# EAGLE design Youssef DHRIF (EAGLE 7.2.0)
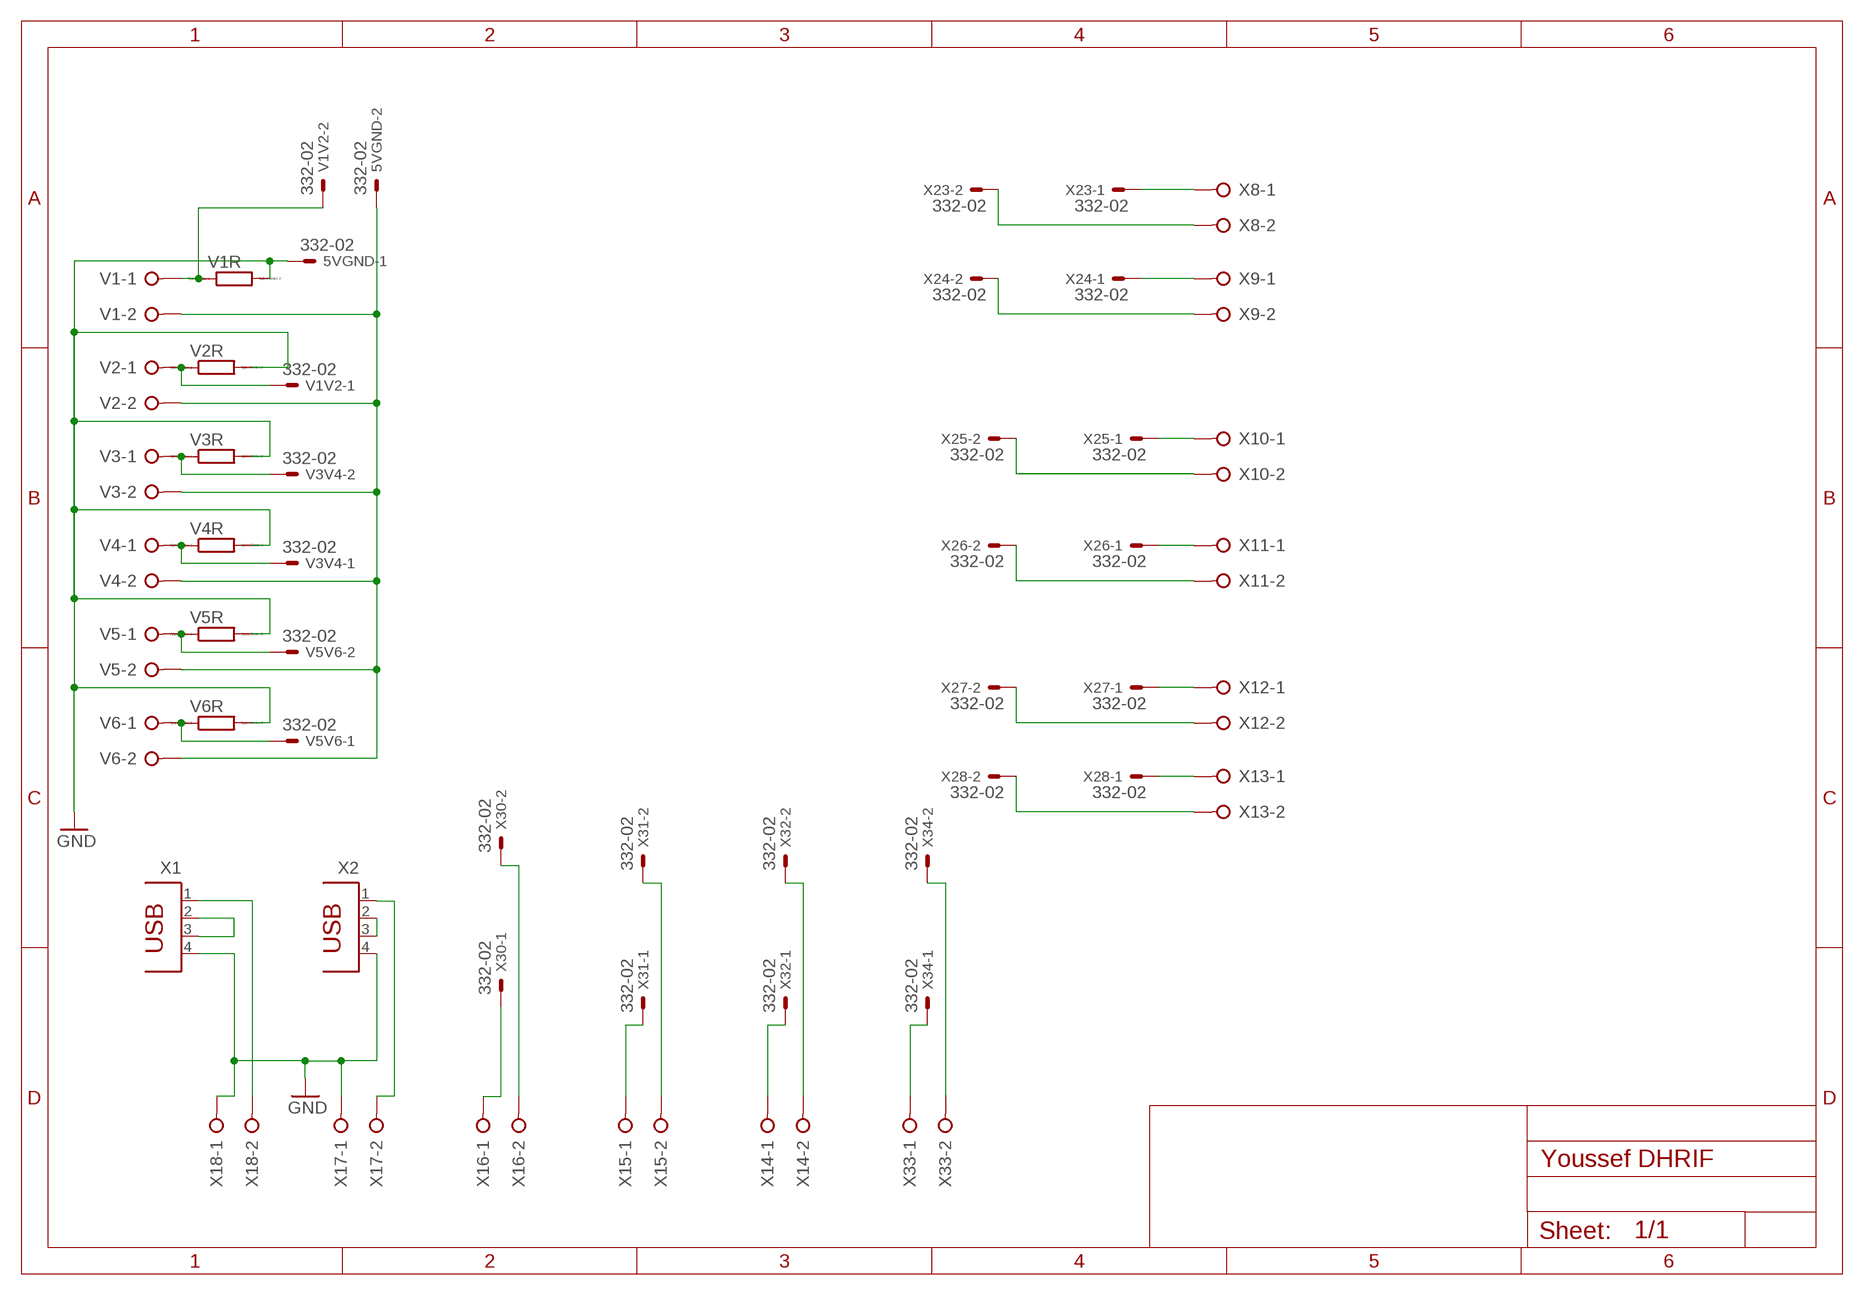
[diagram p0: schematic, sheet 1]

## Parts
5VGND  332-02  [332-02]
V1  W237-02P  [W237-132]
V1R  R0207/10  [0207/10]
V1V2  332-02  [332-02]
V2  W237-02P  [W237-132]
V2R  R0207/10  [0207/10]
V3  W237-02P  [W237-132]
V3R  R0207/10  [0207/10]
V3V4  332-02  [332-02]
V4  W237-02P  [W237-132]
V4R  R0207/10  [0207/10]
V5  W237-02P  [W237-132]
V5R  R0207/10  [0207/10]
V5V6  332-02  [332-02]
V6  W237-02P  [W237-132]
V6R  R0207/10  [0207/10]
X1  PN87520  [PN87520]
X2  PN87520  [PN87520]
X8  W237-02P  [W237-132]
X9  W237-02P  [W237-132]
X10  W237-02P  [W237-132]
X11  W237-02P  [W237-132]
X12  W237-02P  [W237-132]
X13  W237-02P  [W237-132]
X14  W237-02P  [W237-132]
X15  W237-02P  [W237-132]
X16  W237-02P  [W237-132]
X17  W237-02P  [W237-132]
X18  W237-02P  [W237-132]
X23  332-02  [332-02]
X24  332-02  [332-02]
X25  332-02  [332-02]
X26  332-02  [332-02]
X27  332-02  [332-02]
X28  332-02  [332-02]
X30  332-02  [332-02]
X31  332-02  [332-02]
X32  332-02  [332-02]
X33  W237-02P  [W237-132]
X34  332-02  [332-02]

## Nets
GND: 5VGND.1 V1R.2 V2R.2 V3R.2 V4R.2 V5R.2 V6R.2 X1.4 X2.4 X17.1 X18.1
N$2: 5VGND.2 V1.2 V2.2 V3.2 V4.2 V5.2 V6.2
N$3: V5V6.1 V6.1 V6R.1
N$4: V5.1 V5R.1 V5V6.2
N$5: V3V4.1 V4.1 V4R.1
N$6: V3.1 V3R.1 V3V4.2
N$7: V1V2.1 V2.1 V2R.1
N$8: V1.1 V1R.1 V1V2.2
N$9: X8.1 X23.1
N$10: X8.2 X23.2
N$11: X9.1 X24.1
N$12: X9.2 X24.2
N$13: X10.1 X25.1
N$14: X10.2 X25.2
N$15: X11.1 X26.1
N$16: X11.2 X26.2
N$17: X12.1 X27.1
N$18: X12.2 X27.2
N$19: X13.1 X28.1
N$20: X13.2 X28.2
N$21: X1.1 X18.2
N$23: X1.2 X1.3
N$25: X2.1 X17.2
N$26: X2.2 X2.3
N$27: X16.1 X30.1
N$28: X16.2 X30.2
N$29: X15.1 X31.1
N$30: X15.2 X31.2
N$31: X14.1 X32.1
N$32: X14.2 X32.2
N$33: X33.1 X34.1
N$34: X33.2 X34.2

## Library data of the parts
5VGND V1V2 V3V4 V5V6 X23-X28 X30-X32 X34 = con-garry:332-02: 2 Pin - 2mm Dual Row Source: www.mpe-connector.de / garry_shortform_2012.pdf
V1-V6 X8-X18 X33 = con-wago-508:W237-02P: WAGO SREW CLAMP; OC_FARNELL: unknown; OC_NEWARK: unknown
V1R V2R V3R V4R V5R V6R = eagle-ltspice:R: RESISTOR, European symbol; SPICEMODEL: NONE; SPICEPREFIX: R
X1 X2 = con-berg:PN87520: BERG USB connector; OC_FARNELL: unknown; OC_NEWARK: unknown

## Board
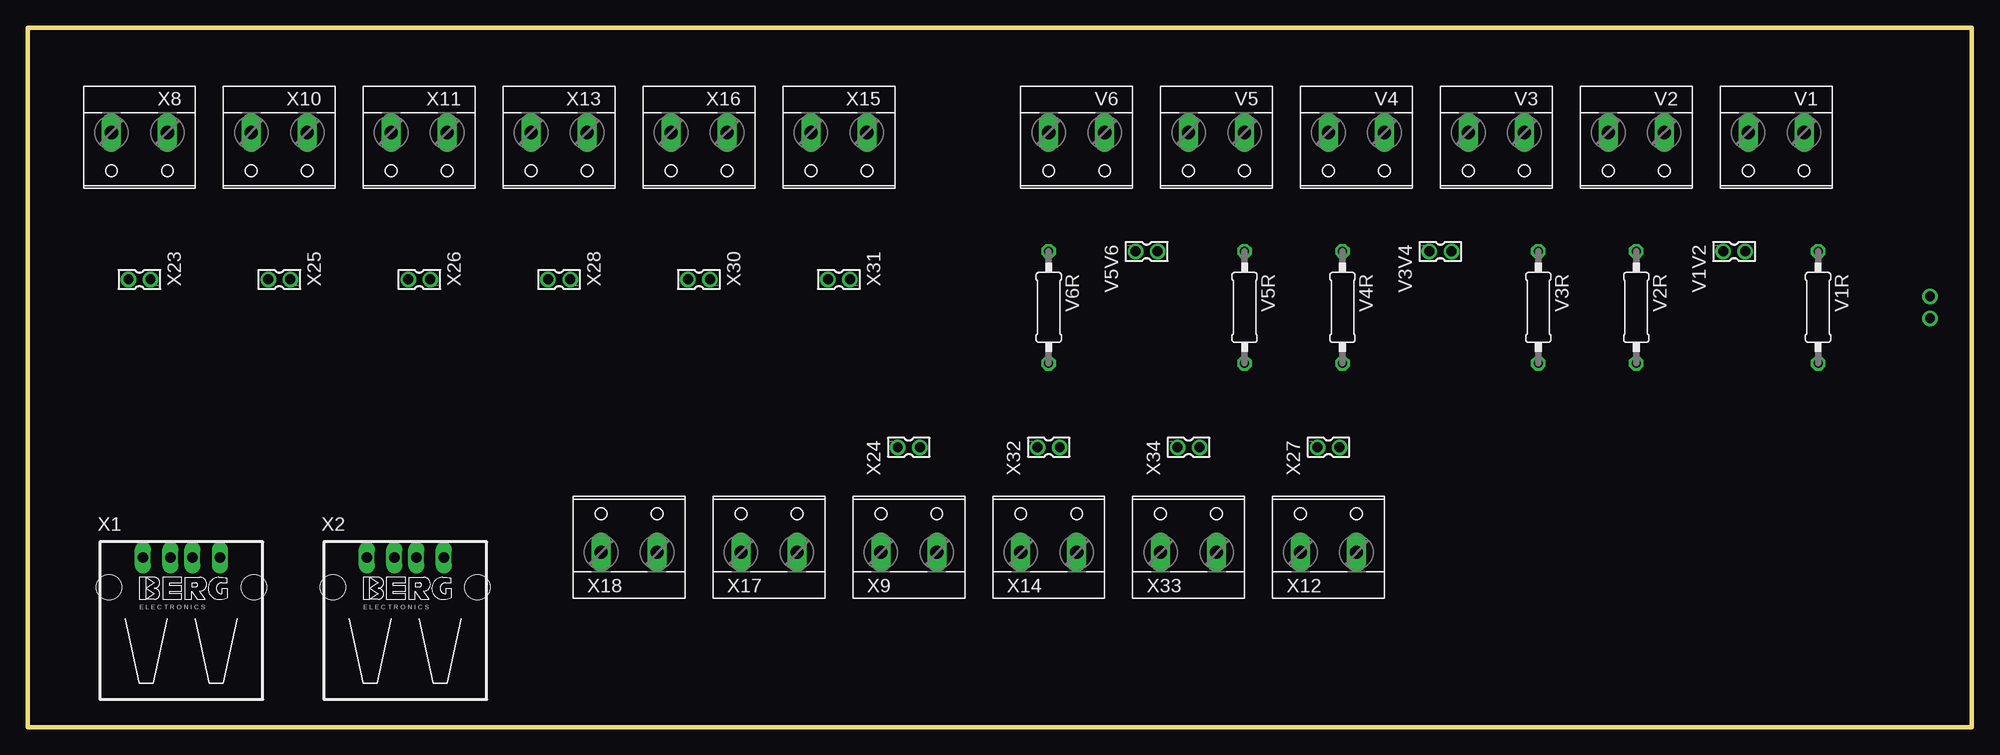
[diagram p1: board, top side]
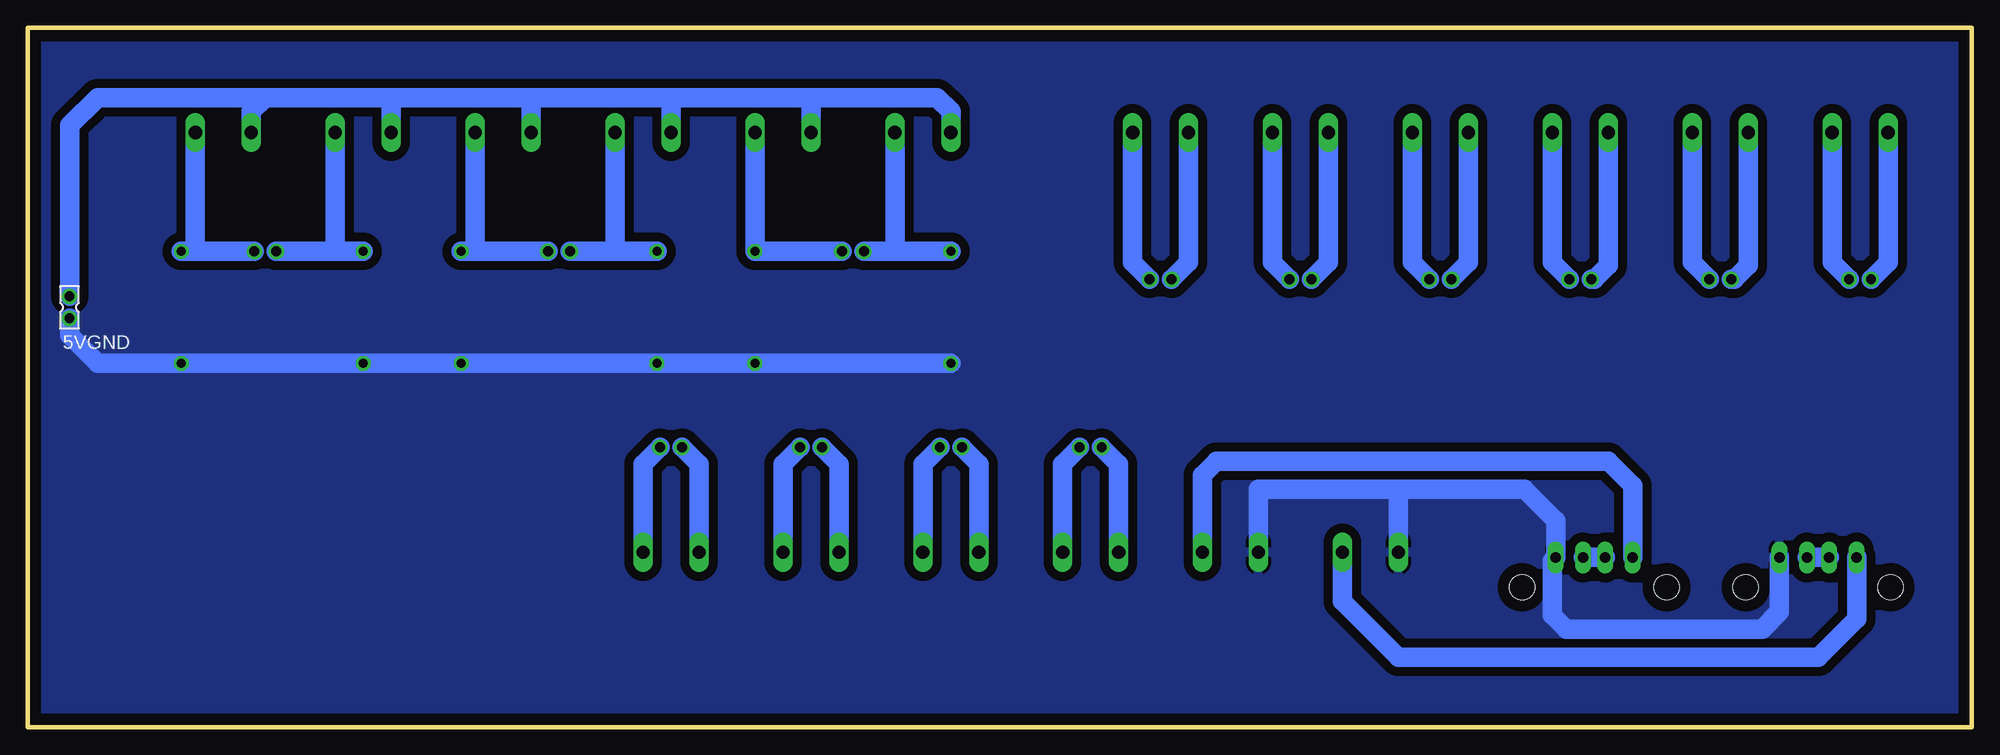
[diagram p2: board, bottom side, seen from below]

Size 176.53 x 63.5 mm. Coordinates in mm from the lower left corner, seen from the top.
Outline: 0,63.5 0,0 176.53,0 176.53,63.5 0,63.5
Copper layers (1*16): Top 0.035mm / dielectric 1.5mm / Bottom 0.035mm
Design rules "default": minimum track width 10mil, minimum drill 24mil, track to track 8mil, track to pad 8mil, pad to pad 8mil, via to via 8mil, smd to smd 8mil, copper to edge 40mil, drill to drill 8mil, minimum pad ring 10mil, minimum via ring 8mil, stop-mask expansion 4mil, vias tented up to drill 0mil, thermal gap 10mil

### Footprints (pad centres in the part's own frame; a part is rotated, then mirrored left to right if it is on the bottom)
332-02 = drill 0.9 pad 1.27: 1 0,-1; 2 0,1
W237-132 = drill 1.194 long: 1 -2.54,-0.635; 2 2.54,-0.635
0207/10 = drill 0.813 octagon: 1 -5.08,0; 2 5.08,0
PN87520 = drill 0.95 long: 1 -3.5,2.71; 2 -1,2.71; 3 1,2.71; 4 3.5,2.71 | hole 2.3: -6.57,0; 6.57,0

### Placement (x,y rotation side)
5VGND  172.72,38.1 0 bottom
V1  158.75,53.34 180 top
V1R  162.56,38.1 270 top
V1V2  154.94,43.18 270 top
V2  146.05,53.34 180 top
V2R  146.05,38.1 270 top
V3  133.35,53.34 180 top
V3R  137.16,38.1 270 top
V3V4  128.27,43.18 270 top
V4  120.65,53.34 180 top
V4R  119.38,38.1 270 top
V5  107.95,53.34 180 top
V5R  110.49,38.1 270 top
V5V6  101.6,43.18 270 top
V6  95.25,53.34 180 top
V6R  92.71,38.1 270 top
X1  13.97,12.7 0 top
X2  34.29,12.7 0 top
X8  10.16,53.34 180 top
X9  80.01,16.51 0 top
X10  22.86,53.34 180 top
X11  35.56,53.34 180 top
X12  118.11,16.51 0 top
X13  48.26,53.34 180 top
X14  92.71,16.51 0 top
X15  73.66,53.34 180 top
X16  60.96,53.34 180 top
X17  67.31,16.51 0 top
X18  54.61,16.51 0 top
X23  10.16,40.64 90 top
X24  80.01,25.4 270 top
X25  22.86,40.64 90 top
X26  35.56,40.64 90 top
X27  118.11,25.4 270 top
X28  48.26,40.64 90 top
X30  60.96,40.64 90 top
X31  73.66,40.64 90 top
X32  92.71,25.4 270 top
X33  105.41,16.51 0 top
X34  105.41,25.4 270 top

### Tracks (layer width: path | path; a pad name or v marks a point on that pad's centre or on a via)
GND
  Bottom 1.778: V6R.2 V5R.2 V4R.2 V3R.2 V2R.2 V1R.2 170.18,33.02 172.72,35.56 5VGND.1 | X1.4 17.47,10.47 19.05,8.89 36.83,8.89 38.1,10.16 38.1,15.1 X2.4 37.79,18.74 40.64,21.59 52.07,21.59 | X18.1 52.07,21.59 | 52.07,21.59 64.77,21.59 X17.1
  pour Bottom (isolate 0.813): 0,0 0,63.5 176.53,63.5 176.53,0 1.27,0
N$2
  Bottom 1.778: V6.2 92.71,55.88 93.98,57.15 105.41,57.15 | 105.41,57.15 118.11,57.15 | 118.11,57.15 130.81,57.15 | 130.81,57.15 143.51,57.15 | 143.51,57.15 154.94,57.15 | V2.2 143.51,57.15 | V5.2 105.41,57.15 | V4.2 118.11,57.15 | V3.2 130.81,57.15 | V1.2 156.21,55.88 154.94,57.15 | 154.94,57.15 170.18,57.15 172.72,54.61 5VGND.2
N$3
  Bottom 1.778: V6R.1 97.79,43.18 | 97.79,43.18 V5V6.1 | V6.1 97.79,43.18
N$4
  Bottom 1.778: V5.1 V5R.1 V5V6.2
N$5
  Bottom 1.778: V3V4.1 123.19,43.18 | 123.19,43.18 V4R.1 | V4.1 123.19,43.18
N$6
  Bottom 1.778: V3R.1 135.89,43.18 | 135.89,43.18 V3V4.2 | V3.1 135.89,43.18
N$7
  Bottom 1.778: V2R.1 148.59,43.18 | 148.59,43.18 V1V2.1 | V2.1 148.59,43.18
N$8
  Bottom 1.778: V1R.1 161.29,43.18 | 161.29,43.18 V1V2.2 | V1.1 161.29,43.18
N$9
  Bottom 1.778: X8.1 12.7,42.18 X23.1
N$10
  Bottom 1.778: X8.2 7.62,42.18 X23.2
N$11
  Bottom 1.778: X9.1 77.47,23.86 X24.1
N$12
  Bottom 1.778: X9.2 82.55,23.86 X24.2
N$13
  Bottom 1.778: X10.1 25.4,42.18 X25.1
N$14
  Bottom 1.778: X10.2 20.32,41.91 21.59,40.64 X25.2
N$15
  Bottom 1.778: X11.1 38.1,42.18 X26.1
N$16
  Bottom 1.778: X11.2 33.02,41.91 34.29,40.64 X26.2
N$17
  Bottom 1.778: X12.1 115.57,23.86 X27.1
N$18
  Bottom 1.778: X12.2 120.65,23.86 X27.2
N$19
  Bottom 1.778: X13.1 50.8,42.18 X28.1
N$20
  Bottom 1.778: X13.2 45.72,42.18 X28.2
N$21
  Bottom 1.778: X1.1 10.47,9.85 13.97,6.35 52.07,6.35 57.15,11.43 X18.2
N$23
  Bottom 1.778: X1.3 X1.2
N$25
  Bottom 1.778: X17.2 69.85,22.86 68.58,24.13 33.02,24.13 30.79,21.9 X2.1
N$26
  Bottom 1.778: X2.3 X2.2
N$27
  Bottom 1.778: X16.1 63.5,42.18 X30.1
N$28
  Bottom 1.778: X16.2 58.42,42.18 X30.2
N$29
  Bottom 1.778: X15.1 76.2,42.18 X31.1
N$30
  Bottom 1.778: X15.2 71.12,42.18 X31.2
N$31
  Bottom 1.778: X14.1 90.17,23.86 X32.1
N$32
  Bottom 1.778: X14.2 95.25,23.86 X32.2
N$33
  Bottom 1.778: X33.1 102.87,23.86 X34.1
N$34
  Bottom 1.778: X33.2 107.95,23.86 X34.2